# EasyEDA Pro project Jalousee PCB.eprj, board PCB4
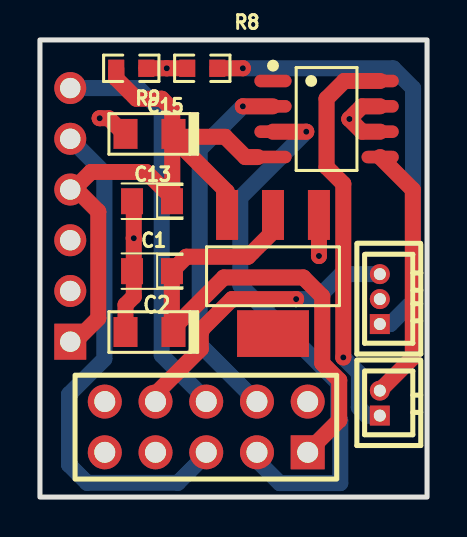
[diagram p13: board, top side]
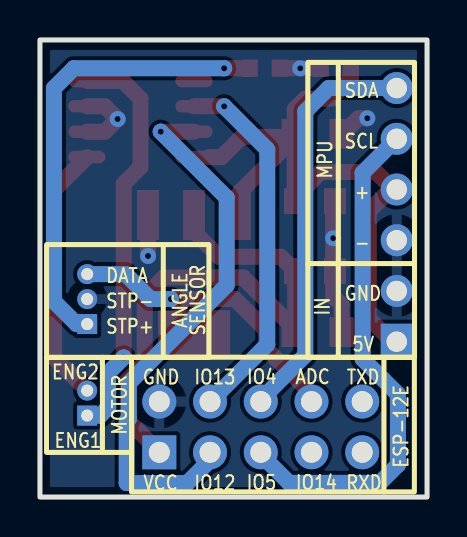
[diagram p14: board, bottom side, seen from below]

Outline 19.38 x 22.89 mm; copper layers: Top Layer, Bottom Layer. Coordinates in mm from the lower left corner of the outline.
Outline path: rectangle 0,22.89 19.38,0
Stack: Top Layer 0.035mm / Dielectric1 1.51mm FR4 er 4.5 / Bottom Layer 0.035mm

## Design rules (mm)
spacing safeClearance (default): track to track 0.152, other pairs 0.152 to 0.3
track width trackWidth (default): min 0.127, default 0.254, max 2.54
differential pair differentialPair (default): width min 0.127, default 0.254, max 2.54; gap min 0.152, default 0.152
via viaSize (default): diameter min 0.5, default 0.61, max 10; hole min 0.3, default 0.305, max 6

## Placement (name value [footprint] x y rotation side)
C1  10uF  [CAP-SMD_L2.0-W1.3-FD]  5.61 11.31 180 top
C2  100nF  [CAP-SMD_L3.2-W1.6-FD]  5.48 8.26 180 top
C13  10uF  [CAP-SMD_L2.0-W1.3-FD]  5.61 14.81 180 top
C15  100nF  [CAP-SMD_L3.2-W1.6-FD]  5.48 18.18 180 top
ESP1  -  [ESP12 10P]  -97.41 23.5 180 top
R8  4.7kΩ  [R0603]  8.13 21.47 0 top
R9  1kΩ  [R0603]  4.57 21.47 180 top
U9  -  [SOT-223-3_L6.5-W3.4-P2.30-LS7.0-BR]  11.67 11.16 90 top
U10  -  [SOP-8_L4.9-W3.9-P1.27-LS6.0-BL]  14.35 18.93 270 top
UENG1  -  [CONN-TH_2P-P1.25_HCTL_HC-1.25-2A]  17.02 4.7 90 top
UEXT1  -  [HDR-TH_6P-P2.54-V-F]  1.52 14.13 90 top
USTP1  -  [CONN-TH_3P-P1.25_HCTL_HC-1.25-3A]  17.02 9.91 90 top

## Footprints (pads in the part's own frame, mm; a bottom-side part is the same pattern mirrored in y, then rotated)
CAP-SMD_L2.0-W1.3-FD
  rect 1.1x1.3 smd: 1(-1,0) 2(1,0)
CAP-SMD_L3.2-W1.6-FD
  rect 1.2x1.5 smd: 1(-1.2,0) 2(1.2,0)
CONN-TH_2P-P1.25_HCTL_HC-1.25-2A
  rect 1x1 hole 0.6: 1(-0.625,0)
  round 1 hole 0.6: 2(0.625,0)
CONN-TH_3P-P1.25_HCTL_HC-1.25-3A
  rect 1x1 hole 0.6: 1(-1.25,0)
  round 1 hole 0.6: 2(0,0) 3(1.25,0)
ESP12 10P
  rect 1.7x1.7 hole 1.05: 1(-110.816,21.261)
  round 1.7 hole 1.05: 2(-110.816,18.721) 3(-108.275,21.261) 4(-108.275,18.721) 5(-105.736,21.261) 6(-105.736,18.721) 7(-103.195,21.261) 8(-103.195,18.721) 9(-100.656,21.261) 10(-100.656,18.721)
HDR-TH_6P-P2.54-V-F
  rect 1.8x1.6 hole 1.02: 1(-6.35,0)
  round 1.6 hole 1.02: 2(-3.81,0) 3(-1.27,0) 4(1.27,0) 5(3.81,0) 6(6.35,0)
R0603
  rect 0.806x0.864 smd: 1(-0.753,0) 2(0.753,0)
SOP-8_L4.9-W3.9-P1.27-LS6.0-BL
  oval 0.63x1.865 smd: 1(-1.905,-2.683) 2(-0.635,-2.683) 3(0.635,-2.683) 4(1.905,-2.683) 5(1.905,2.683) 6(0.635,2.683) 7(-0.635,2.683) 8(-1.905,2.683)
SOT-223-3_L6.5-W3.4-P2.30-LS7.0-BR
  rect 2.5x1.1 smd: 1(2.97,-2.3) 2(2.97,0) 3(2.97,2.3)
  rect 2.34x3.6 smd: 4(-2.97,0)

## Nets
As in the schematic.

Pads without a net: ESP1 7 9 10; U9 4; U10 1

## Via types
v1: diameter 0.8, hole 0.305, Top Layer to Bottom Layer, 10 vias

## Routing (per net, layer and track width the routed paths; a pad name or vN(x,y) marks a point on that pad's centre or on a via; arc(x,y) is an arc through that point)
$1N603: length 27.8
  Top Layer w0.8: v1(13.34,18.29) U10.3
  Bottom Layer w0.8: v1(13.34,18.29) 10.03,14.99 10.03,10.61 14.93,5.71 14.93,3.91 15.04,3.8 15.04,0.7 12.01,0.7 10.85,1.86 10.85,2.25
$1N605: length 18.4
  Top Layer w0.8: v1(10.16,19.56) U10.2
  Bottom Layer w0.8: 10.85,4.79 8,7.64 8,17.41 v1(10.16,19.56)
$1N607: length 27.3
  Top Layer w0.8: U9.2 11.67,13.28 10.42,12.03 7.33,12.03 6.6,11.31 6.6,8.55 6.68,8.47 9.21,11 13.19,11 14.14,10.05 14.14,6.7 14.99,5.85 14.99,3.85 13.39,2.25
$1N608: length 13.1
  Top Layer w0.8: UENG1.2 18.67,6.98 18.67,15.39 U10.5
$1N610: length 20.4
  Top Layer w0.8: U10.8 15.24,20.83 14.35,19.94 14.35,16.52 15.19,15.68 v1(15.19,6.99)
  Bottom Layer w0.8: v1(15.19,6.99) 15.97,6.21 15.97,4.49 16.37,4.08 UENG1.1
$1N611: length 32.4
  Top Layer w0.8: 6.83,18.04 9.27,18.04 10.29,17.02 10.91,17.02 ; 6.63,18.02 6.63,14.97 5.32,16.28 2.56,16.28 1.75,15.47 2.92,14.3 2.92,8.95 1.78,7.81 ; 6.63,18.02 9.35,15.29 9.35,14.14 ; 6.63,18.02 6.57,18.07 ; 6.63,18.02 6.63,19.42 6.1,19.94 4.83,19.94 3.82,20.95 R9.2
$1N5181: length 25.7
  Bottom Layer w0.8: 8.38,2.18 6.91,0.71 2.36,0.71 1.46,1.61 1.46,5.15 3.23,6.92 3.23,16.23 UEXT1.5
$1N5352: length 20.4
  Bottom Layer w0.8: 8.31,4.89 6.1,7.1 6.1,19.31 4.93,20.48 UEXT1.6
$1N12303: length 15.8
  Top Layer w0.8: U10.7 16.13,19.56 v1(15.49,18.93) 16.13,18.29 U10.6 ; C2.2 4.28,9.62 4.7,10.04 v1(4.7,12.96) 4.7,14.71 ; 4.23,18.18 3.44,18.97 v1(2.99,18.97) ; R9.1 v1(6.35,21.47) 7.24,21.47 ; v1(13.97,12.07) 13.97,14.12
$1N12304: length 14.6
  Top Layer w0.8: 5.77,4.79 5.77,5.14 8.05,7.43 8.05,8.29 8.1,8.33 8.1,8.39 9.62,9.91 v1(12.83,9.91)
  Bottom Layer w0.8: v1(12.83,9.91) 13.84,9.91 15.09,11.16 USTP1.3
$1N12305: length 23
  Top Layer w0.8: v1(10.16,21.47) 8.89,21.47
  Bottom Layer w0.8: USTP1.1 17.55,8.66 18.68,9.8 18.68,20.47 17.69,21.47 v1(10.16,21.47)

## Copper pours and planes (outline as drawn; the poured copper is in the pictures)
$1N12303 on Bottom Layer: -0.04,22.97 19.45,22.97 19.45,-0.01 -0.04,-0.01

## Text on the board
Bottom Silkscreen Layer: + | - | 5V | SDA | SCL | GND | DATA | STP- | STP+ | ENG2 | ESP-12E | SENSOR | MOTOR | ENG1 | ANGLE | MPU | IN | TXD | RXD | IO14 | ADC | IO4 | IO5 | IO13 | IO12 | VCC
Top Silkscreen Layer: C2
